# EAGLE design TinymeshBreakout1 (EAGLE 7.6.0)
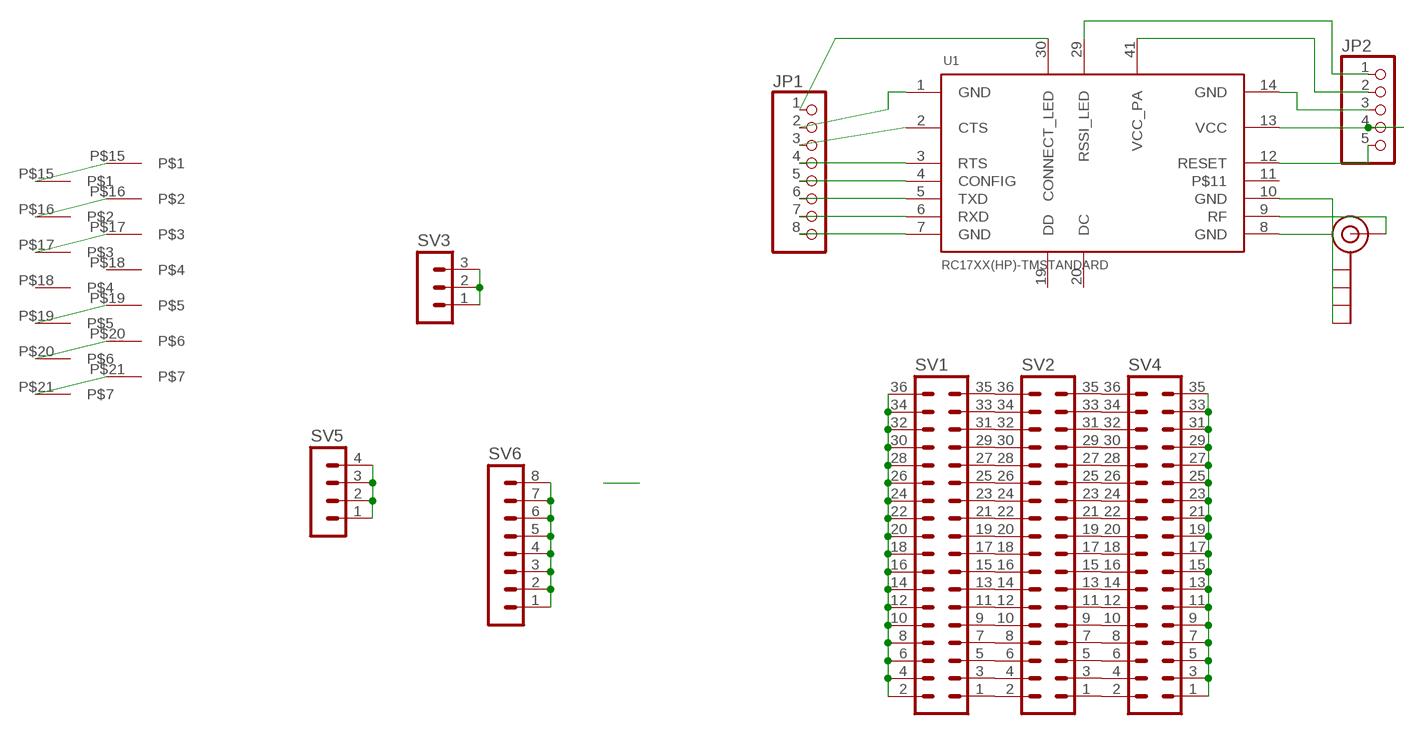
[diagram p0: schematic, sheet 1]

## Parts
J$1  SMA_EDGE  [SMA-EDGE]
JP1  PINHD-1X8  [1X08]
JP2  PINHD-1X5  [1X05]
SV1  MA18-2  [MA18-2]
SV2  MA18-2  [MA18-2]
SV3  MA03-1  [MA03-1]
SV4  MA18-2  [MA18-2]
SV5  MA04-1  [MA04-1]
SV6  MA08-1  [MA08-1]
U1  RC17XX(HP)-TMSTANDARD  [RC17XX(HP)-TM]
U$1  OEMSRR  [OEMSRR]
U$2  OEMSRR  [OEMSRR]

## Nets
GND: J$1.GND@2(GND) J$1.GND@3(GND) JP1.2 JP2.3 SV1.2 SV1.4 SV1.6 SV1.8 SV1.10 SV1.12 SV1.14 SV1.16 SV1.18 SV1.20 SV1.22 SV1.24 SV1.26 SV1.28 SV1.30 SV1.32 SV1.34 SV1.36 U1.1(GND) U1.8(GND) U1.10(GND) U1.14(GND)
N$1: SV1.1 SV2.2
N$2: SV1.3 SV2.4
N$3: J$1.SIG(SIGNAL) U1.9(RF)
N$4: JP2.5 U1.12(RESET)
N$5: SV1.5 SV2.6
N$6: SV1.7 SV2.8
N$7: SV1.9 SV2.10
N$8: SV1.11 SV2.12
N$9: JP1.7 U1.6(RXD)
N$10: JP1.6 U1.5(TXD)
N$11: JP1.5 U1.4(CONFIG)
N$12: JP1.4 U1.3(RTS)
N$13: JP1.3 U1.2(CTS)
N$14: SV1.13 SV2.14
N$15: JP1.1 U1.30(CONNECT_LED)
N$16: JP2.1 U1.29(RSSI_LED)
N$17: SV1.15 SV2.16
N$18: SV1.17 SV2.18
N$19: SV1.19 SV2.20
N$20: SV1.21 SV2.22
N$21: SV1.23 SV2.24
N$22: SV1.25 SV2.26
N$23: SV1.27 SV2.28
N$24: SV1.29 SV2.30
N$25: SV1.31 SV2.32
N$26: SV1.33 SV2.34
N$27: SV1.35 SV2.36
N$28: SV2.1 SV4.2
N$29: SV2.3 SV4.4
N$30: SV2.5 SV4.6
N$31: SV2.7 SV4.8
N$32: U$1.P$15 U$2.P$15
N$33: JP2.4 U1.13(VCC)
N$34: JP1.8 U1.7(GND)
N$36: SV2.9 SV4.10
N$37: SV2.11 SV4.12
N$38: SV2.13 SV4.14
N$39: SV2.15 SV4.16
N$40: SV2.17 SV4.18
N$41: SV2.19 SV4.20
N$42: SV2.21 SV4.22
N$43: SV2.23 SV4.24
N$44: SV2.25 SV4.26
N$45: SV2.27 SV4.28
N$46: SV2.29 SV4.30
N$47: SV2.31 SV4.32
N$48: SV2.33 SV4.34
N$49: SV2.35 SV4.36
N$50: U$1.P$16 U$2.P$16
N$51: SV4.1 SV4.3 SV4.5 SV4.7 SV4.9 SV4.11 SV4.13 SV4.15 SV4.17 SV4.19 SV4.21 SV4.23 SV4.25 SV4.27 SV4.29 SV4.31 SV4.33 SV4.35
N$52: U$1.P$17 U$2.P$17
N$91: U$1.P$19 U$2.P$19
N$92: U$1.P$20 U$2.P$20
N$93: U$1.P$21 U$2.P$21
N$126: SV5.1 SV5.2 SV5.3 SV5.4
N$127: SV6.1 SV6.2 SV6.3 SV6.4 SV6.5 SV6.6 SV6.7 SV6.8
N$128: SV3.1 SV3.2 SV3.3
VCC: JP2.2 U1.41(VCC_PA)
Unconnected: J$1.GND@0(GND) J$1.GND@1(GND) U1.11 U1.19(DD) U1.20(DC) U$1.P$18 U$2.P$18

## Library data of the parts
J$1 = SparkFun-Connectors:SMA_EDGE: SMA Antenna Connector End launch SMA connector. The paste layer has been removed so that the connector can be hand soldered onto the board after reflow.
JP1 = pinhead:PINHD-1X8: PIN HEADER
JP2 = pinhead:PINHD-1X5: PIN HEADER
SV1 SV2 SV4 = con-lstb:MA18-2: PIN HEADER; OC_FARNELL: unknown; OC_NEWARK: unknown
SV3 = con-lstb:MA03-1: PIN HEADER; OC_FARNELL: unknown; OC_NEWARK: unknown
SV5 = con-lstb:MA04-1: PIN HEADER; OC_FARNELL: unknown; OC_NEWARK: unknown
SV6 = con-lstb:MA08-1: PIN HEADER; OC_FARNELL: unknown; OC_NEWARK: unknown
U1 = PerLengq:RC17XX(HP)-TM
U$1 U$2 = PerLengq:OEMSRR

## Board
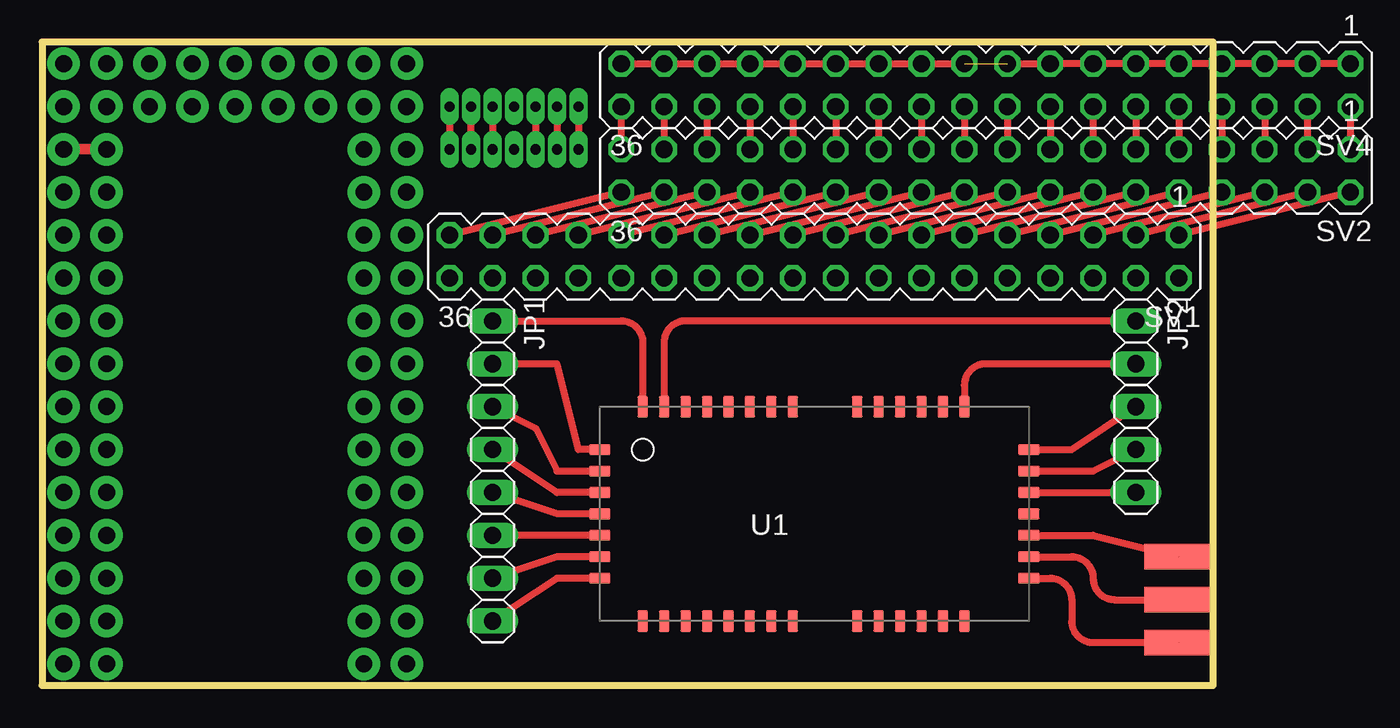
[diagram p1: board, top side]
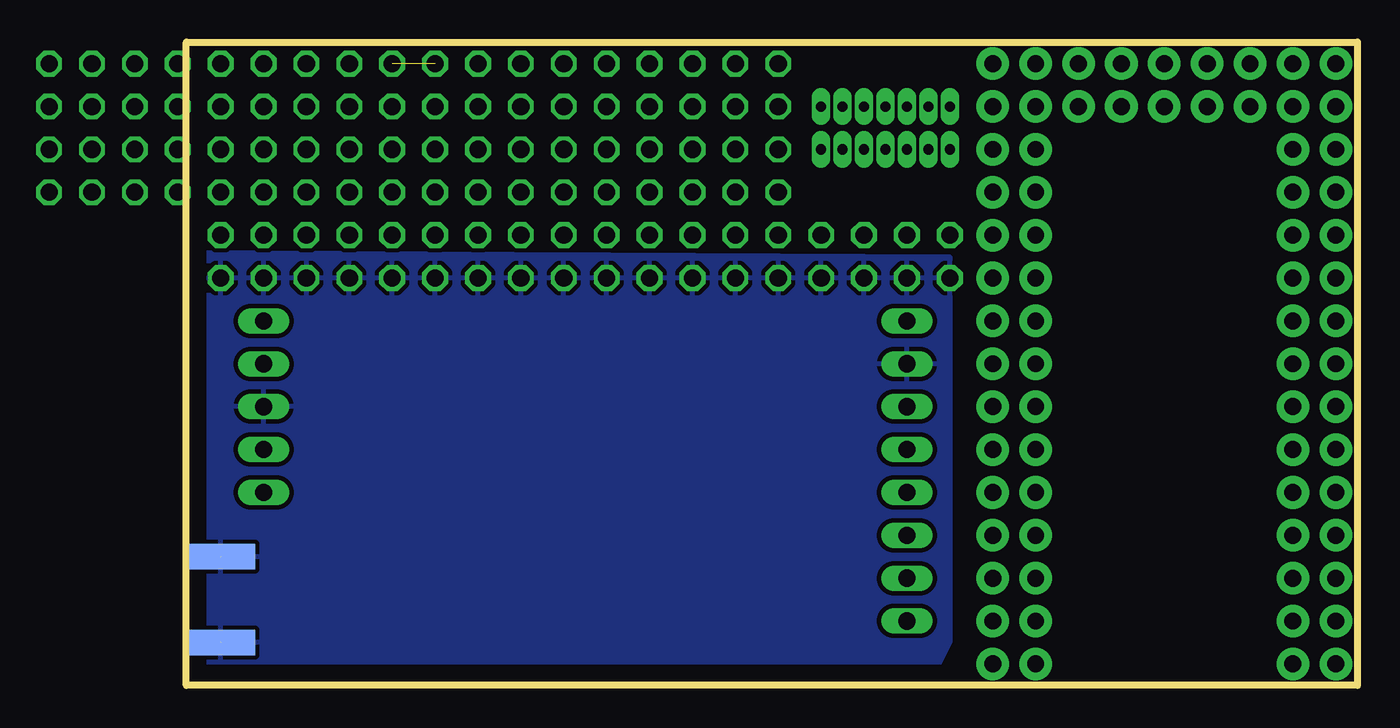
[diagram p2: board, bottom side, seen from below]

Size 69.34 x 38.1 mm. Coordinates in mm from the lower left corner, seen from the top.
Outline: 0,0 69.34,0 69.34,38.1 0,38.1 0,0
Copper layers (1*16): Top 0.035mm / dielectric 1.5mm / Bottom 0.035mm
Design rules "default": minimum track width 10mil, minimum drill 24mil, track to track 8mil, track to pad 8mil, pad to pad 8mil, via to via 8mil, smd to smd 8mil, copper to edge 40mil, drill to drill 8mil, minimum pad ring 10mil, minimum via ring 8mil, stop-mask expansion 4mil, vias tented up to drill 0mil, thermal gap 10mil
tKeepout: area 34.3,5.1 to 57.2,15.2

### Footprints (pad centres in the part's own frame; a part is rotated, then mirrored left to right if it is on the bottom)
SMA-EDGE = smd 1.524 x 4.064: GND@0 0,0; GND@1 5.08,0; SIG 2.54,0 | smd 1.524 x 4.064 bottom: GND@2 0,0; GND@3 5.08,0
1X08 = drill 1.016 long: 1 -8.89,0; 2 -6.35,0; 3 -3.81,0; 4 -1.27,0; 5 1.27,0; 6 3.81,0; 7 6.35,0; 8 8.89,0
1X05 = drill 1.016 long: 1 -5.08,0; 2 -2.54,0; 3 0,0; 4 2.54,0; 5 5.08,0
MA18-2 = drill 1.016 octagon: 1 -21.59,-1.27; 2 -21.59,1.27; 3 -19.05,-1.27; 4 -19.05,1.27; 5 -16.51,-1.27; 6 -16.51,1.27; 7 -13.97,-1.27; 8 -13.97,1.27; 9 -11.43,-1.27; 10 -11.43,1.27; 11 -8.89,-1.27; 12 -8.89,1.27; 13 -6.35,-1.27; 14 -6.35,1.27; 15 -3.81,-1.27; 16 -3.81,1.27; 17 -1.27,-1.27; 18 -1.27,1.27; 19 1.27,-1.27; 20 1.27,1.27; 21 3.81,-1.27; 22 3.81,1.27; 23 6.35,-1.27; 24 6.35,1.27; 25 8.89,-1.27; 26 8.89,1.27; 27 11.43,-1.27; 28 11.43,1.27; 29 13.97,-1.27; 30 13.97,1.27; 31 16.51,-1.27; 32 16.51,1.27; 33 19.05,-1.27; 34 19.05,1.27; 35 21.59,-1.27; 36 21.59,1.27
MA03-1 = drill 1.016 long: 1 -2.54,0; 2 0,0; 3 2.54,0
MA04-1 = drill 1.016 long: 1 -3.81,0; 2 -1.27,0; 3 1.27,0; 4 3.81,0
MA08-1 = drill 1.016 long: 1 -8.89,0; 2 -6.35,0; 3 -3.81,0; 4 -1.27,0; 5 1.27,0; 6 3.81,0; 7 6.35,0; 8 8.89,0
RC17XX(HP)-TM = smd 1.27 x 0.635: 1 -12.7,3.81; 2 -12.7,2.54; 3 -12.7,1.27; 4 -12.7,0; 5 -12.7,-1.27; 6 -12.7,-2.54; 7 -12.7,-3.81; 8 12.7,-3.81; 9 12.7,-2.54; 10 12.7,-1.27; 11 12.7,0; 12 12.7,1.27; 13 12.7,2.54; 14 12.7,3.81 | smd 0.635 x 1.27: 15 -10.16,-6.35; 16 -8.89,-6.35; 17 -7.62,-6.35; 18 -6.35,-6.35; 19 -5.08,-6.35; 20 -3.81,-6.35; 21 -2.54,-6.35; 22 -1.27,-6.35; 23 -1.27,6.35; 24 -2.54,6.35; 25 -3.81,6.35; 26 -5.08,6.35; 27 -6.35,6.35; 28 -7.62,6.35; 29 -8.89,6.35; 30 -10.16,6.35; 31 2.54,6.35; 32 2.54,-6.35; 33 3.81,6.35; 34 3.81,-6.35; 35 5.08,6.35; 36 5.08,-6.35; 37 6.35,6.35; 38 6.35,-6.35; 39 7.62,6.35; 40 7.62,-6.35; 41 8.89,6.35; 42 8.89,-6.35
OEMSRR = drill 0.6 pad 1.016 long: P$15 0,7.62; P$16 0,6.35; P$17 0,5.08; P$18 0,3.81; P$19 0,2.54; P$20 0,1.27; P$21 0,0

### Placement (x,y rotation side)
J$1  67.31,2.54 90 top
JP1  26.67,12.7 270 top
JP2  64.77,16.51 270 top
SV1  45.72,25.4 180 top
SV2  55.88,30.48 180 top
SV3  -1.27,-6.35 0 top  (outside the outline)
SV4  55.88,35.56 180 top
SV5  0,-12.7 0 top  (outside the outline)
SV6  3.81,-19.05 0 top  (outside the outline)
U1  45.72,10.16 0 top
U$1  24.13,31.75 270 top
U$2  24.13,34.29 270 top

### Tracks (layer width: path | path; a pad name or v marks a point on that pad's centre or on a via)
GND  (2 unrouted)
  Top 0.406: U1.8 59.69,6.35 arc-90 60.96,5.08 60.96,3.81 arc90 62.23,2.54 J$1.GND@2 | U1.10 62.23,8.89 J$1.GND@3 68.58,7.62 | U1.14 60.96,13.97 JP2.3 | U1.1 31.75,13.97 30.48,19.05 JP1.2
  pour Bottom (isolate 0.254): 24.13,2.54 25.4,0 69.34,0.25 69.34,25.65 24.13,25.4
N$1
  Top 0.406: SV2.2 SV1.1
N$2
  Top 0.406: SV2.4 SV1.3
N$3
  Top 0.406: U1.9 60.96,7.62 arc-90 62.23,6.35 arc90 63.5,5.08 J$1.SIG
N$4
  Top 0.406: U1.12 JP2.5
N$5
  Top 0.406: SV2.6 SV1.5
N$6
  Top 0.406: SV2.8 SV1.7
N$7
  Top 0.406: SV2.10 SV1.9
N$8
  Top 0.406: SV2.12 SV1.11
N$9
  Top 0.406: U1.6 30.48,7.62 JP1.7
N$10
  Top 0.406: U1.5 JP1.6
N$11
  Top 0.406: U1.4 30.48,10.16 JP1.5
N$12
  Top 0.406: U1.3 30.48,11.43 JP1.4
N$13
  Top 0.406: JP1.3 29.21,15.24 30.48,12.7 U1.2
N$14
  Top 0.406: SV2.14 SV1.13
N$15
  Top 0.406: JP1.1 34.29,21.59 arc-90 35.56,20.32 U1.30
N$16
  Top 0.406: JP2.1 38.1,21.59 arc90 36.83,20.32 U1.29
N$17
  Top 0.406: SV2.16 SV1.15
N$18
  Top 0.406: SV2.18 SV1.17
N$19
  Top 0.406: SV2.20 SV1.19
N$20
  Top 0.406: SV1.21 SV2.22
N$21
  Top 0.406: SV2.24 SV1.23
N$22
  Top 0.406: SV1.25 SV2.26
N$23
  Top 0.406: SV2.28 SV1.27
N$24
  Top 0.406: SV2.30 SV1.29
N$25
  Top 0.406: SV2.32 SV1.31
N$26
  Top 0.406: SV2.34 SV1.33
N$27
  Top 0.406: SV2.36 SV1.35
N$28
  Top 0.406: SV4.2 SV2.1
N$29
  Top 0.406: SV4.4 SV2.3
N$30
  Top 0.406: SV4.6 SV2.5
N$31
  Top 0.406: SV4.8 SV2.7
N$32
  Top 0.406: U$2.P$15 U$1.P$15
N$33
  Top 0.406: U1.13 62.23,12.7 JP2.4
N$34
  Top 0.406: U1.7 30.48,6.35 JP1.8
N$36
  Top 0.406: SV4.10 SV2.9
N$37
  Top 0.406: SV4.12 SV2.11
N$38
  Top 0.406: SV4.14 SV2.13
N$39
  Top 0.406: SV4.16 SV2.15
N$40
  Top 0.406: SV4.18 SV2.17
N$41
  Top 0.406: SV4.20 SV2.19
N$42
  Top 0.406: SV4.22 SV2.21
N$43
  Top 0.406: SV4.24 SV2.23
N$44
  Top 0.406: SV4.26 SV2.25
N$45
  Top 0.406: SV4.28 SV2.27
N$46
  Top 0.406: SV4.30 SV2.29
N$47
  Top 0.406: SV4.32 SV2.31
N$48
  Top 0.406: SV4.34 SV2.33
N$49
  Top 0.406: SV4.36 SV2.35
N$50
  Top 0.406: U$2.P$16 U$1.P$16
N$51  (1 unrouted)
  Top 0.406: SV4.35 SV4.33 SV4.31 SV4.29 SV4.27 SV4.25 SV4.23 SV4.21 SV4.19 | SV4.17 SV4.15 SV4.13 SV4.11 SV4.9 SV4.7 SV4.5 SV4.3 SV4.1
N$52
  Top 0.406: U$2.P$17 U$1.P$17
N$53  (via drill 1 pad 1.93)
  other vias: 1.27,29.21
N$54  (via drill 1 pad 1.93)
  other vias: 1.27,26.67
N$55  (via drill 1 pad 1.93)
  other vias: 1.27,24.13
N$56  (via drill 1 pad 1.93)
  other vias: 1.27,21.59
N$57  (via drill 1 pad 1.93)
  other vias: 1.27,19.05
N$58  (via drill 1 pad 1.93)
  other vias: 1.27,16.51
N$59  (via drill 1 pad 1.93)
  other vias: 1.27,13.97
N$60  (via drill 1 pad 1.93)
  other vias: 1.27,11.43
N$61  (via drill 1 pad 1.93)
  other vias: 1.27,8.89
N$62  (via drill 1 pad 1.93)
  other vias: 1.27,6.35
N$63  (via drill 1 pad 1.93)
  other vias: 1.27,3.81
N$64  (via drill 1 pad 1.93)
  other vias: 1.27,1.27
N$65  (via drill 1 pad 1.93)
  other vias: 21.59,1.27
N$66  (via drill 1 pad 1.93)
  other vias: 21.59,3.81
N$67  (via drill 1 pad 1.93)
  other vias: 21.59,6.35
N$68  (via drill 1 pad 1.93)
  other vias: 21.59,8.89
N$69  (via drill 1 pad 1.93)
  other vias: 21.59,11.43
N$70  (via drill 1 pad 1.93)
  other vias: 21.59,13.97
N$71  (via drill 1 pad 1.93)
  other vias: 21.59,16.51
N$72  (via drill 1 pad 1.93)
  other vias: 21.59,19.05
N$73  (via drill 1 pad 1.93)
  other vias: 21.59,21.59
N$74  (via drill 1 pad 1.93)
  other vias: 21.59,24.13
N$75  (via drill 1 pad 1.93)
  other vias: 21.59,26.67
N$76  (via drill 1 pad 1.93)
  other vias: 21.59,29.21
N$77  (via drill 1 pad 1.93)
  other vias: 21.59,31.75
N$78  (via drill 1 pad 1.93)
  other vias: 21.59,34.29
N$79  (via drill 1 pad 1.93)
  other vias: 21.59,36.83
N$80  (via drill 1 pad 1.93)
  other vias: 19.05,36.83
N$81  (via drill 1 pad 1.93)
  other vias: 16.51,36.83
N$82  (via drill 1 pad 1.93)
  other vias: 13.97,36.83
N$83  (via drill 1 pad 1.93)
  other vias: 11.43,36.83
N$84  (via drill 1 pad 1.93)
  other vias: 8.89,36.83
N$85  (via drill 1 pad 1.93)
  other vias: 6.35,36.83
N$86  (via drill 1 pad 1.93)
  other vias: 3.81,36.83
N$87  (via drill 1 pad 1.93)
  other vias: 1.27,36.83
N$88  (via drill 1 pad 1.93)
  Top 0.61: v1.27,31.75 v3.81,31.75
N$89  (via drill 1 pad 1.93)
  other vias: 1.27,34.29
N$91
  Top 0.406: U$2.P$19 U$1.P$19
N$92
  Top 0.406: U$1.P$20 U$2.P$20
N$93
  Top 0.406: U$2.P$21 U$1.P$21
N$94  (via drill 1 pad 1.93)
  other vias: 3.81,34.29
N$95  (via drill 1 pad 1.93)
  other vias: 6.35,34.29
N$96  (via drill 1 pad 1.93)
  other vias: 8.89,34.29
N$97  (via drill 1 pad 1.93)
  other vias: 11.43,34.29
N$98  (via drill 1 pad 1.93)
  other vias: 13.97,34.29
N$99  (via drill 1 pad 1.93)
  other vias: 16.51,34.29
N$100  (via drill 1 pad 1.93)
  other vias: 19.05,34.29
N$101  (via drill 1 pad 1.93)
  other vias: 19.05,31.75
N$102  (via drill 1 pad 1.93)
  other vias: 19.05,29.21
N$103  (via drill 1 pad 1.93)
  other vias: 19.05,26.67
N$104  (via drill 1 pad 1.93)
  other vias: 19.05,24.13
N$105  (via drill 1 pad 1.93)
  other vias: 19.05,21.59
N$106  (via drill 1 pad 1.93)
  other vias: 19.05,19.05
N$107  (via drill 1 pad 1.93)
  other vias: 19.05,16.51
N$108  (via drill 1 pad 1.93)
  other vias: 19.05,13.97
N$109  (via drill 1 pad 1.93)
  other vias: 19.05,11.43
N$110  (via drill 1 pad 1.93)
  other vias: 19.05,8.89
N$111  (via drill 1 pad 1.93)
  other vias: 19.05,6.35
N$112  (via drill 1 pad 1.93)
  other vias: 19.05,3.81
N$113  (via drill 1 pad 1.93)
  other vias: 19.05,1.27
N$114  (via drill 1 pad 1.93)
  other vias: 3.81,1.27
N$115  (via drill 1 pad 1.93)
  other vias: 3.81,3.81
N$116  (via drill 1 pad 1.93)
  other vias: 3.81,6.35
N$117  (via drill 1 pad 1.93)
  other vias: 3.81,8.89
N$118  (via drill 1 pad 1.93)
  other vias: 3.81,11.43
N$119  (via drill 1 pad 1.93)
  other vias: 3.81,13.97
N$120  (via drill 1 pad 1.93)
  other vias: 3.81,16.51
N$121  (via drill 1 pad 1.93)
  other vias: 3.81,19.05
N$122  (via drill 1 pad 1.93)
  other vias: 3.81,21.59
N$123  (via drill 1 pad 1.93)
  other vias: 3.81,24.13
N$124  (via drill 1 pad 1.93)
  other vias: 3.81,26.67
N$125  (via drill 1 pad 1.93)
  other vias: 3.81,29.21
N$126  (3 unrouted)
N$127  (7 unrouted)
N$128  (2 unrouted)
VCC
  Top 0.406: JP2.2 55.88,19.05 arc90 54.61,17.78 U1.41